# Altium schematic sheet micro.SchDoc
size A4
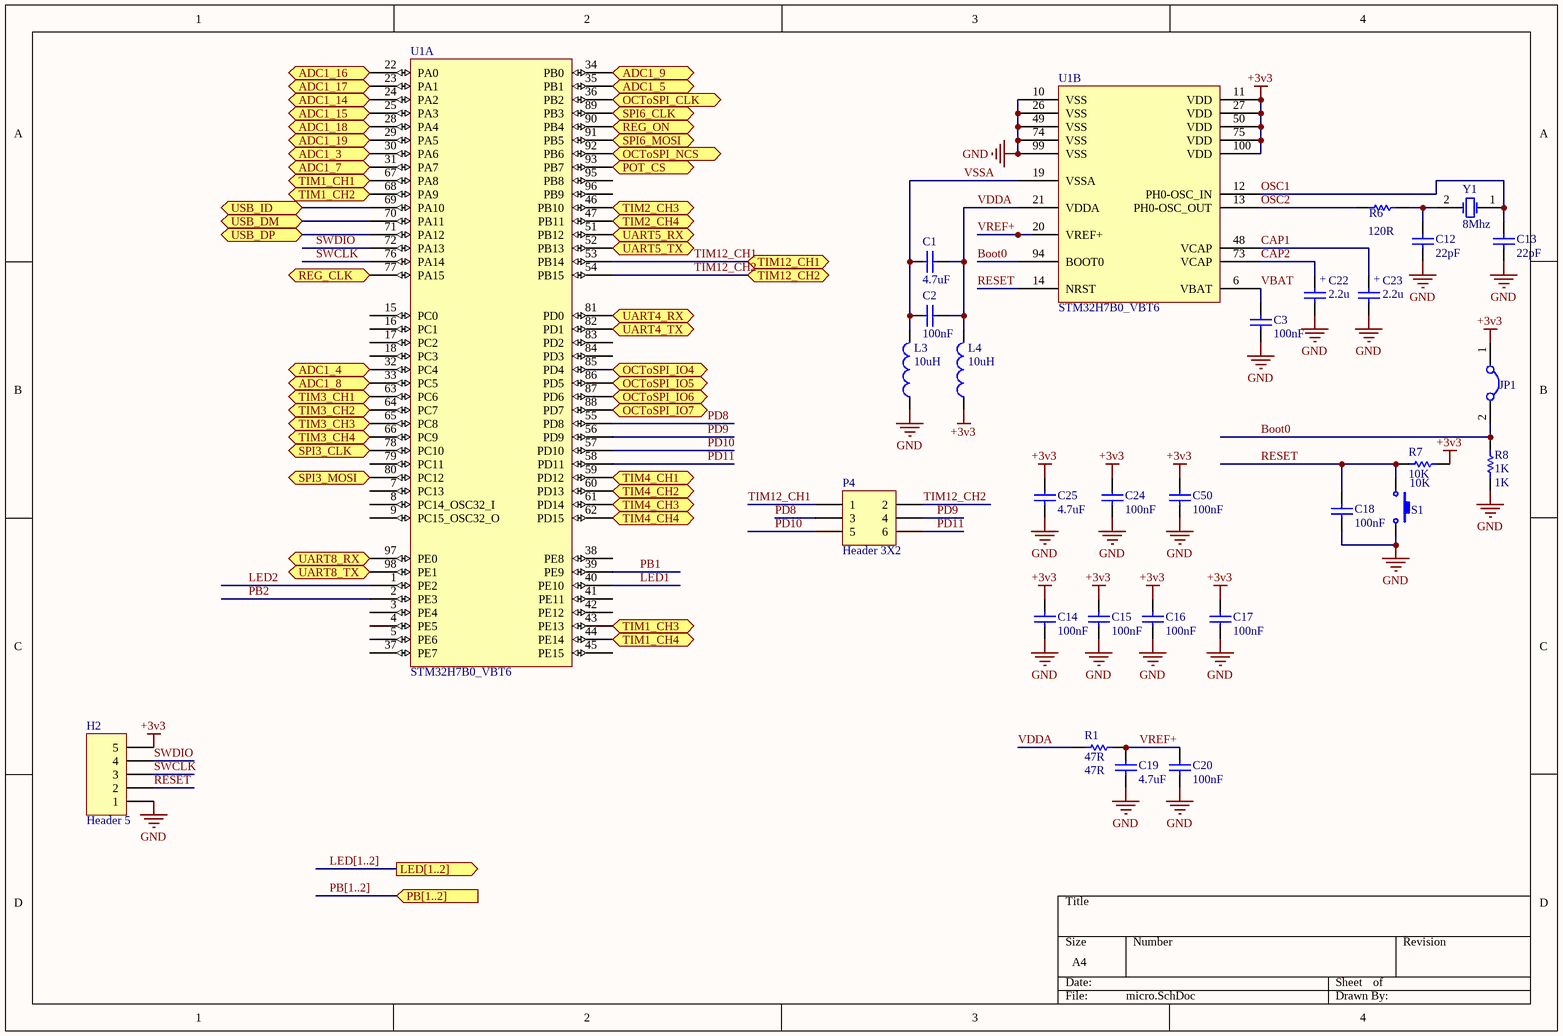
[diagram p0: micro.SchDoc]

## Parts
C1  4.7uF  [SMD_CAP_0805]
C2  100nF  [SMD_CAP_0805]
C3  100nF  [SMD_CAP_0805]
C12  22pF  [SMD_CAP_0805]
C13  22pF  [SMD_CAP_0805]
C14  100nF  [SMD_CAP_0805]
C15  100nF  [SMD_CAP_0805]
C16  100nF  [SMD_CAP_0805]
C17  100nF  [SMD_CAP_0805]
C18  100nF  [SMD_CAP_0805]
C19  4.7uF  [SMD_CAP_0805]
C20  100nF  [SMD_CAP_0805]
C22  value 2.2u  [SMD_CAP_0805]  (hidden comment: tantal size a)
C23  value 2.2u  [SMD_CAP_0805]  (hidden comment: tantal size a)
C24  100nF  [SMD_CAP_0805]
C25  4.7uF  [SMD_CAP_0805]
C50  100nF  [SMD_CAP_0805]
H2  Header 5  [HDR1X5]
JP1  Jumper  [Jumper Small - 2.54 - GRAY]  (value not drawn)
L3  value 10uH  [IND1206]  (hidden comment: inductor 10uH)
L4  value 10uH  [IND1206]  (hidden comment: inductor 10uH)
P4  Header 3X2  [HDR2X3]
R1  47R  [RES 0805 (2012X06L)]
R6  120R  [RES 0805 (2012X06L)]
R7  10K  [RES 0805 (2012X06L)]
R8  1K  [RES 0805 (2012X06L)]
S1  Switch PB  [Switch - Push to On]  (value not drawn)
U1  STM32H7B0_VBT6  [LQFP100_N]  (parts A,B of 2)
Y1  8Mhz  [CRYSTAL Small]

## Ports
ADC1_3 (bidir), ADC1_4 (bidir), ADC1_5 (bidir), ADC1_7 (bidir), ADC1_8 (bidir), ADC1_9 (bidir), ADC1_14 (bidir), ADC1_15 (bidir), ADC1_16 (bidir), ADC1_17 (bidir), ADC1_18 (bidir), ADC1_19 (bidir), LED[1..2] (out), OCToSPI_CLK (bidir), OCToSPI_IO4 (bidir), OCToSPI_IO5 (bidir), OCToSPI_IO6 (bidir), OCToSPI_IO7 (bidir), OCToSPI_NCS (bidir), PB[1..2] (in), POT_CS (bidir), REG_CLK (bidir), REG_ON (bidir), SPI3_CLK (bidir), SPI3_MOSI (bidir), SPI6_CLK (bidir), SPI6_MOSI (bidir), TIM1_CH1 (bidir), TIM1_CH2 (bidir), TIM1_CH3 (bidir), TIM1_CH4 (bidir), TIM2_CH3 (bidir), TIM2_CH4 (bidir), TIM3_CH1 (bidir), TIM3_CH2 (bidir), TIM3_CH3 (bidir), TIM3_CH4 (bidir), TIM4_CH1 (bidir), TIM4_CH2 (bidir), TIM4_CH3 (bidir), TIM4_CH4 (bidir), TIM12_CH1 (bidir), TIM12_CH2 (bidir), UART4_RX (bidir), UART4_TX (bidir), UART5_RX (bidir), UART5_TX (bidir), UART8_RX (bidir), UART8_TX (bidir), USB_DM (bidir), USB_DP (bidir), USB_ID (bidir)

## Nets
+3v3: C14.2 C15.2 C16.2 C17.2 C24.2 C25.1 C50.1 H2.5 JP1.1 L4.1 R7.1 U1.11(VDD) U1.27(VDD) U1.50(VDD) U1.75(VDD) U1.100(VDD)
GND: C3.1 C12.1 C13.1 C14.1 C15.1 C16.1 C17.1 C18.1 C19.2 C20.1 C22.- C23.- C24.1 C25.2 C50.2 H2.1 L3.1 R8.1 S1.2 U1.10(VSS) U1.26(VSS) U1.49(VSS) U1.74(VSS) U1.99(VSS)
ADC1_3: U1.30(PA6) ; port ADC1_3
ADC1_4: U1.32(PC4) ; port ADC1_4
ADC1_5: U1.35(PB1) ; port ADC1_5
ADC1_7: U1.31(PA7) ; port ADC1_7
ADC1_8: U1.33(PC5) ; port ADC1_8
ADC1_9: U1.34(PB0) ; port ADC1_9
ADC1_14: U1.24(PA2) ; port ADC1_14
ADC1_15: U1.25(PA3) ; port ADC1_15
ADC1_16: U1.22(PA0) ; port ADC1_16
ADC1_17: U1.23(PA1) ; port ADC1_17
ADC1_18: U1.28(PA4) ; port ADC1_18
ADC1_19: U1.29(PA5) ; port ADC1_19
Boot0: JP1.2 R8.2 U1.94(BOOT0)
CAP1: C23.+ U1.48(VCAP)
CAP2: C22.+ U1.73(VCAP)
LED1: U1.40(PE10)
LED2: U1.1(PE2)
OCToSPI_CLK: U1.36(PB2) ; port OCToSPI_CLK
OCToSPI_IO4: U1.85(PD4) ; port OCToSPI_IO4
OCToSPI_IO5: U1.86(PD5) ; port OCToSPI_IO5
OCToSPI_IO6: U1.87(PD6) ; port OCToSPI_IO6
OCToSPI_IO7: U1.88(PD7) ; port OCToSPI_IO7
OCToSPI_NCS: U1.92(PB6) ; port OCToSPI_NCS
OSC1: C13.2 U1.12(PH0-OSC_IN) Y1.1(OSC1)
OSC2: R6.1 U1.13(PH0-OSC_OUT)
PB1: U1.39(PE9)
PB2: U1.2(PE3)
PD8: P4.3 U1.55(PD8)
PD9: P4.4 U1.56(PD9)
PD10: P4.5 U1.57(PD10)
PD11: P4.6 U1.58(PD11)
POT_CS: U1.93(PB7) ; port POT_CS
REG_CLK: U1.77(PA15) ; port REG_CLK
REG_ON: U1.90(PB4) ; port REG_ON
RESET: C18.2 H2.2 R7.2 S1.1 U1.14(NRST)
SPI3_CLK: U1.78(PC10) ; port SPI3_CLK
SPI3_MOSI: U1.80(PC12) ; port SPI3_MOSI
SPI6_CLK: U1.89(PB3) ; port SPI6_CLK
SPI6_MOSI: U1.91(PB5) ; port SPI6_MOSI
SWCLK: H2.3 U1.76(PA14)
SWDIO: H2.4 U1.72(PA13)
TIM1_CH1: U1.67(PA8) ; port TIM1_CH1
TIM1_CH2: U1.68(PA9) ; port TIM1_CH2
TIM1_CH3: U1.43(PE13) ; port TIM1_CH3
TIM1_CH4: U1.44(PE14) ; port TIM1_CH4
TIM2_CH3: U1.46(PB10) ; port TIM2_CH3
TIM2_CH4: U1.47(PB11) ; port TIM2_CH4
TIM3_CH1: U1.63(PC6) ; port TIM3_CH1
TIM3_CH2: U1.64(PC7) ; port TIM3_CH2
TIM3_CH3: U1.65(PC8) ; port TIM3_CH3
TIM3_CH4: U1.66(PC9) ; port TIM3_CH4
TIM4_CH1: U1.59(PD12) ; port TIM4_CH1
TIM4_CH2: U1.60(PD13) ; port TIM4_CH2
TIM4_CH3: U1.61(PD14) ; port TIM4_CH3
TIM4_CH4: U1.62(PD15) ; port TIM4_CH4
TIM12_CH1: P4.1 U1.53(PB14) ; port TIM12_CH1
TIM12_CH2: P4.2 U1.54(PB15) ; port TIM12_CH2
UART4_RX: U1.81(PD0) ; port UART4_RX
UART4_TX: U1.82(PD1) ; port UART4_TX
UART5_RX: U1.51(PB12) ; port UART5_RX
UART5_TX: U1.52(PB13) ; port UART5_TX
UART8_RX: U1.97(PE0) ; port UART8_RX
UART8_TX: U1.98(PE1) ; port UART8_TX
USB_DM: U1.70(PA11) ; port USB_DM
USB_DP: U1.71(PA12) ; port USB_DP
USB_ID: U1.69(PA10) ; port USB_ID
VBAT: C3.2 U1.6(VBAT)
VDDA: C1.2 C2.2 L4.2 R1.2 U1.21(VDDA)
VREF+: C19.1 C20.2 R1.1 U1.20(VREF+)
VSSA: C1.1 C2.1 L3.2 U1.19(VSSA)
NetC12_2: C12.2 R6.2 Y1.2(OSC2)

Not connected (* = marked no-connect by the designer): U1 3(PE4) 4(PE5) 5(PE6) 7(PC13) 8(PC14_OSC32_I) 9(PC15_OSC32_O) 15(PC0) 16(PC1) 17(PC2) 18(PC3) 37(PE7) 38(PE8) 41(PE11) 42(PE12) 45(PE15) 79(PC11) 83(PD2) 84(PD3) 95(PB8) 96(PB9)

## Buses and harness runs
bus LED[1..2] = port LED[1..2]
bus PB[1..2] = port PB[1..2]

## Library data of the parts
C1-C3 C19 C25 C50 = Cap
  C1 C19 C25: Value: 4.7uF
  C2 C3 C50: Value: 100nF
C12-C18 C20 C24 = Cap: Capacitor; Published: 8-Jun-2000; LatestRevisionDate: 17-Jul-2002; LatestRevisionNote: Re-released for DXP Platform.; PackageReference: RAD-0.3; Publisher: Altium Limited; PackageDescription: Radial Cap, Thru-Hole; 2 Leads; 0.3 in Pin Spacing
  C12 C13: Value: 22pF
  C14-C18 C20 C24: Value: 100nF
C22 C23 = Cap Pol: pin to pad: +>1 ->2
H2 = Header 5: Header, 5-Pin; LatestRevisionDate: 17-Jul-2002; LatestRevisionNote: Re-released for DXP Platform.; Publisher: Altium Limited
JP1 = Jumper: Company: E.P.I.L; Defualt State: Close; Design Date: 2011/11/02
L3 L4 = Inductor: Code_IEC: 1005; Published: 8-Jun-2000; LatestRevisionDate: 29-May-2009; LatestRevisionNote: IPC-7351 Footprint Added.; PackageReference: 0402-A; Publisher: Altium Limited; PackageDescription: Chip Inductor; Code_JEITA: 0402
P4 = Header 3X2: Header, 3-Pin, Dual row; LatestRevisionDate: 17-Jul-2002; LatestRevisionNote: Re-released for DXP Platform.; Publisher: Altium Limited
R1 R6-R8 = Res1: Resistor; Published: 8-Jun-2000; LatestRevisionDate: 17-Jul-2002; LatestRevisionNote: Re-released for DXP Platform.; PackageReference: AXIAL-0.3; Publisher: Altium Limited; PackageDescription: Axial Device, Thru-Hole; 2 Leads; 0.3 in Pin Spacing
  R1: Value: 47R
  R6: Value: 120R
  R7: Value: 10K
  R8: Value: 1K
S1 = Switch PB: Push Button Switch
U1 = STM32H7B0_VBT6: STM32H7B0_VBT6 LQPF100
Y1 = XTAL: Crystal Oscillator; Published: 8-Jun-2000; LatestRevisionDate: 17-Jul-2002; LatestRevisionNote: Re-released for DXP Platform.; PackageReference: R38; Publisher: Altium Limited; PackageDescription: Crystal, Thru-Hole; 2 Leads; Body 3.1 x 8.2 mm (Dia.xH)